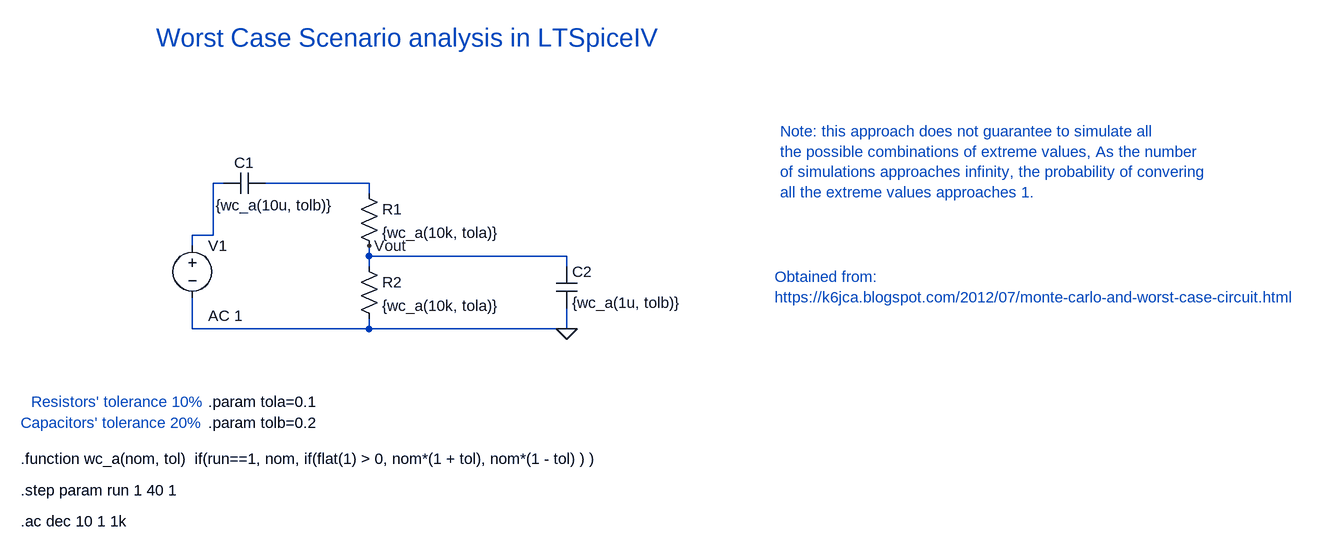
[diagram p0: schematic Worst-Case-Scenario-Simulation-LTSpice.asc]
Worst-Case-Scenario-Simulation-LTSpice.asc, the LTspice schematic file:
Version 4.1
SHEET 1 1656 736
WIRE 480 240 480 256
WIRE 176 256 176 272
WIRE -96 224 -96 240
WIRE 480 256 480 272
WIRE 480 272 176 272
WIRE 176 272 -96 272
WIRE -96 272 -96 240
FLAG 480 272 0
WIRE -48 48 -64 48
WIRE -96 144 -96 128
WIRE -64 48 -64 128
WIRE -64 128 -96 128
WIRE 16 48 32 48
WIRE 176 64 176 48
WIRE 32 48 176 48
WIRE 480 176 480 160
WIRE 176 144 176 160
WIRE 176 176 176 160
WIRE 480 160 176 160
FLAG 176 144 Vout
SYMBOL voltage -96 128 R0
WINDOW 123 24 124 Left 2
WINDOW 39 0 0 Left 0
SYMATTR Value2 AC 1
SYMATTR InstName V1
SYMATTR Value ""
SYMBOL cap 16 32 R90
WINDOW 0 0 32 VBottom 2
WINDOW 3 34 -15 VTop 2
SYMATTR InstName C1
SYMATTR Value {wc_a(10u, tolb)}
SYMBOL res 160 48 R0
SYMATTR InstName R1
SYMATTR Value {wc_a(10k, tola)}
SYMBOL res 160 160 R0
SYMATTR InstName R2
SYMATTR Value {wc_a(10k, tola)}
SYMBOL cap 464 176 R0
SYMATTR InstName C2
SYMATTR Value {wc_a(1u, tolb)}
TEXT -72 384 Left 2 !.param tola=0.1
TEXT -72 416 Left 2 !.param tolb=0.2
TEXT -360 520 Left 2 !.step param run 1 40 1
TEXT -360 568 Left 2 !.ac dec 10 1 1k
TEXT -344 384 Left 2 ;Resistors' tolerance 10%
TEXT -360 416 Left 2 ;Capacitors' tolerance 20%
TEXT -152 -176 Left 4 ;Worst Case Scenario analysis in LTSpiceIV
TEXT -360 472 Left 2 !.function wc_a(nom, tol)  if(run==1, nom, if(flat(1) > 0, nom*(1 + tol), nom*(1 - tol) ) )
TEXT 808 -32 Left 2 ;Note: this approach does not guarantee to simulate all\nthe possible combinations of extreme values, As the number\nof simulations approaches infinity, the probability of convering\nall the extreme values approaches 1.
TEXT 800 192 Left 2 ;Obtained from:\nhttps://k6jca.blogspot.com/2012/07/monte-carlo-and-worst-case-circuit.html

The netlist it stands for:
* Worst-Case-Scenario-Simulation-LTSpice.asc
V1 N001 0 AC 1
C1 N002 N001 {wc_a(10u, tolb)}
R1 N002 Vout {wc_a(10k, tola)}
R2 Vout 0 {wc_a(10k, tola)}
C2 Vout 0 {wc_a(1u, tolb)}
.param tola=0.1
.param tolb=0.2
.step param run 1 40 1
.ac dec 10 1 1k
* Resistors' tolerance 10%
* Capacitors' tolerance 20%
* Worst Case Scenario analysis in LTSpiceIV
.function wc_a(nom, tol)  if(run==1, nom, if(flat(1) > 0, nom*(1 + tol), nom*(1 - tol) ) )
* Note: this approach does not guarantee to simulate all
* the possible combinations of extreme values, As the number
* of simulations approaches infinity, the probability of convering
* all the extreme values approaches 1.
* Obtained from:
* https://k6jca.blogspot.com/2012/07/monte-carlo-and-worst-case-circuit.html
.backanno
.end